# Altium schematic sheet LedMatrixMain.SchDoc: Led Matrix on Sensor Port
size A4; Revision: 1.0
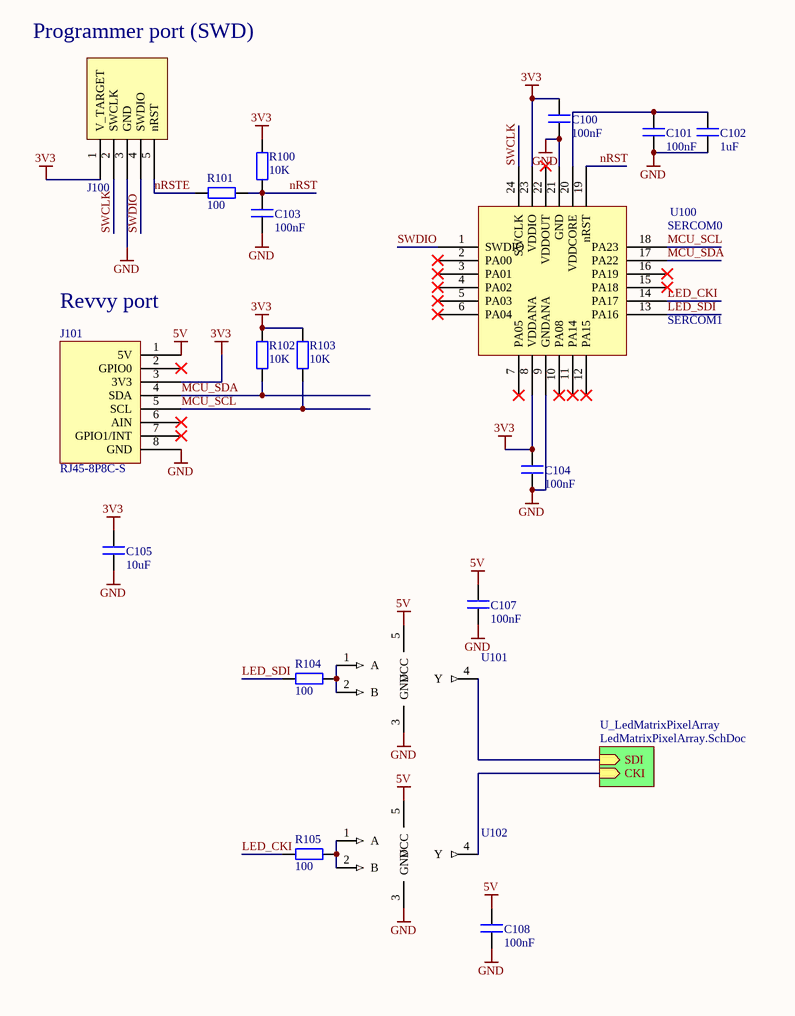
[diagram p0: LedMatrixMain.SchDoc]

## Parts
C100  100nF  [CAP1608X06M]
C101  100nF  [CAP1608X06M]
C102  1uF  [CAP1608X06M]
C103  100nF  [CAP1608X06M]
C104  100nF  [CAP1608X06M]
C105  10uF  [CAP1608X06M]
C107  100nF  [CAP1608X06M]
C108  100nF  [CAP1608X06M]
J100  SWD  [Sullins_GRPB051VWVN-RC]  (value not drawn)
J101  RJ45-8P8C-S  [RJ45-8P8C]
R100  10K  [RESC1608X06M]
R101  100  [RESC1608X06M]
R102  10K  [RESC1608X06M]
R103  10K  [RESC1608X06M]
R104  100  [RESC1608X06M]
R105  100  [RESC1608X06M]
U100  ATSAML10D16  [QFN50P400X400X90_HS-25N]  (value not drawn)
U101  OR gate  [SOT95P270X145-5N]  (value not drawn)
U102  OR gate  [SOT95P270X145-5N]  (value not drawn)

## Sub-sheets
U_LedMatrixPixelArray = LedMatrixPixelArray.SchDoc: SDI (in), CKI (in)

## Nets
3V3: C100.2 C104.2 C105.2 J100.1(V_TARGET) J101.3(3V3) R100.2 R102.2 R103.2 U100.8(VDDANA) U100.23(VDDIO)
5V: C107.2 C108.2 J101.1(5V) U101.5(VCC) U102.5(VCC)
GND: C100.1 C101.1 C102.1 C103.1 C104.1 C105.1 C107.1 C108.1 J100.3(GND) J101.8(GND) U100.9(GNDANA) U100.21(GND) U101.3(GND) U102.3(GND)
LED_CKI: R105.1 U100.14(PA17)
LED_SDI: R104.1 U100.13(PA16)
MCU_SCL: J101.5(SCL) R103.1 U100.18(PA23)
MCU_SDA: J101.4(SDA) R102.1 U100.17(PA22)
nRST: C103.2 R100.1 R101.2 U100.19(nRST)
nRSTE: J100.5(nRST) R101.1
SWCLK: J100.2(SWCLK) U100.24(SWCLK)
SWDIO: J100.4(SWDIO) U100.1(SWDIO)
NetC101_2: C101.2 C102.2 U100.20(VDDCORE)
NetR104_2: R104.2 U101.1(A) U101.2(B)
NetR105_2: R105.2 U102.1(A) U102.2(B)
NetU101_4: U101.4(Y) ; sheet U_LedMatrixPixelArray/SDI
NetU102_4: U102.4(Y) ; sheet U_LedMatrixPixelArray/CKI

Not connected (* = marked no-connect by the designer): J101 2(GPIO0)* 6(AIN)* 7(GPIO1/INT)*; U100 2(PA00)* 3(PA01)* 4(PA02)* 5(PA03)* 6(PA04)* 7(PA05)* 10(PA08)* 11(PA14)* 12(PA15)* 15(PA18)* 16(PA19)* 22(VDDOUT)*

## Notes on the sheet
- Programmer port (SWD)
- (near U100) SERCOM0
- (near J101) Revvy port
- (near U100) SERCOM1

## Library data of the parts
C100 C101 C103 C104 C107 C108 = Capacitor 100n: Value: 100nF
C102 = Capacitor 1u: Value: 1uF
C105 = Capacitor 10u: Value: 10uF
R100 R102 R103 = Resistor 10K: Value: 10K
R101 R104 R105 = Resistor 100: Value: 100
U100 = ATSAML10D16: 48MHz 32bit ARM MCU; Flash size: 16kB; RAM size: 4kB
U101 U102 = SN74LV1T32: Manufacturer_Name: Texas Instruments; Manufacturer_Part_Number: SN74LV1T32DCKR; Datasheet Link: http://www.ti.com/lit/ds/symlink/sn74lv1t32.pdf; Mouser2 Price/Stock: https://hu.mouser.com/Search/Refine?Keyword=SN74LV1T32DCKR; Mouser code: 595-SN74LV1T32DCKR
J101 = RJ45-8P8C-S: Datasheet: /Robotics%20Platform/Datasheets/Connectors/5721-8P8C-全塑有耳.pdf